# Altium schematic sheet Mcu.SchDoc
size A4
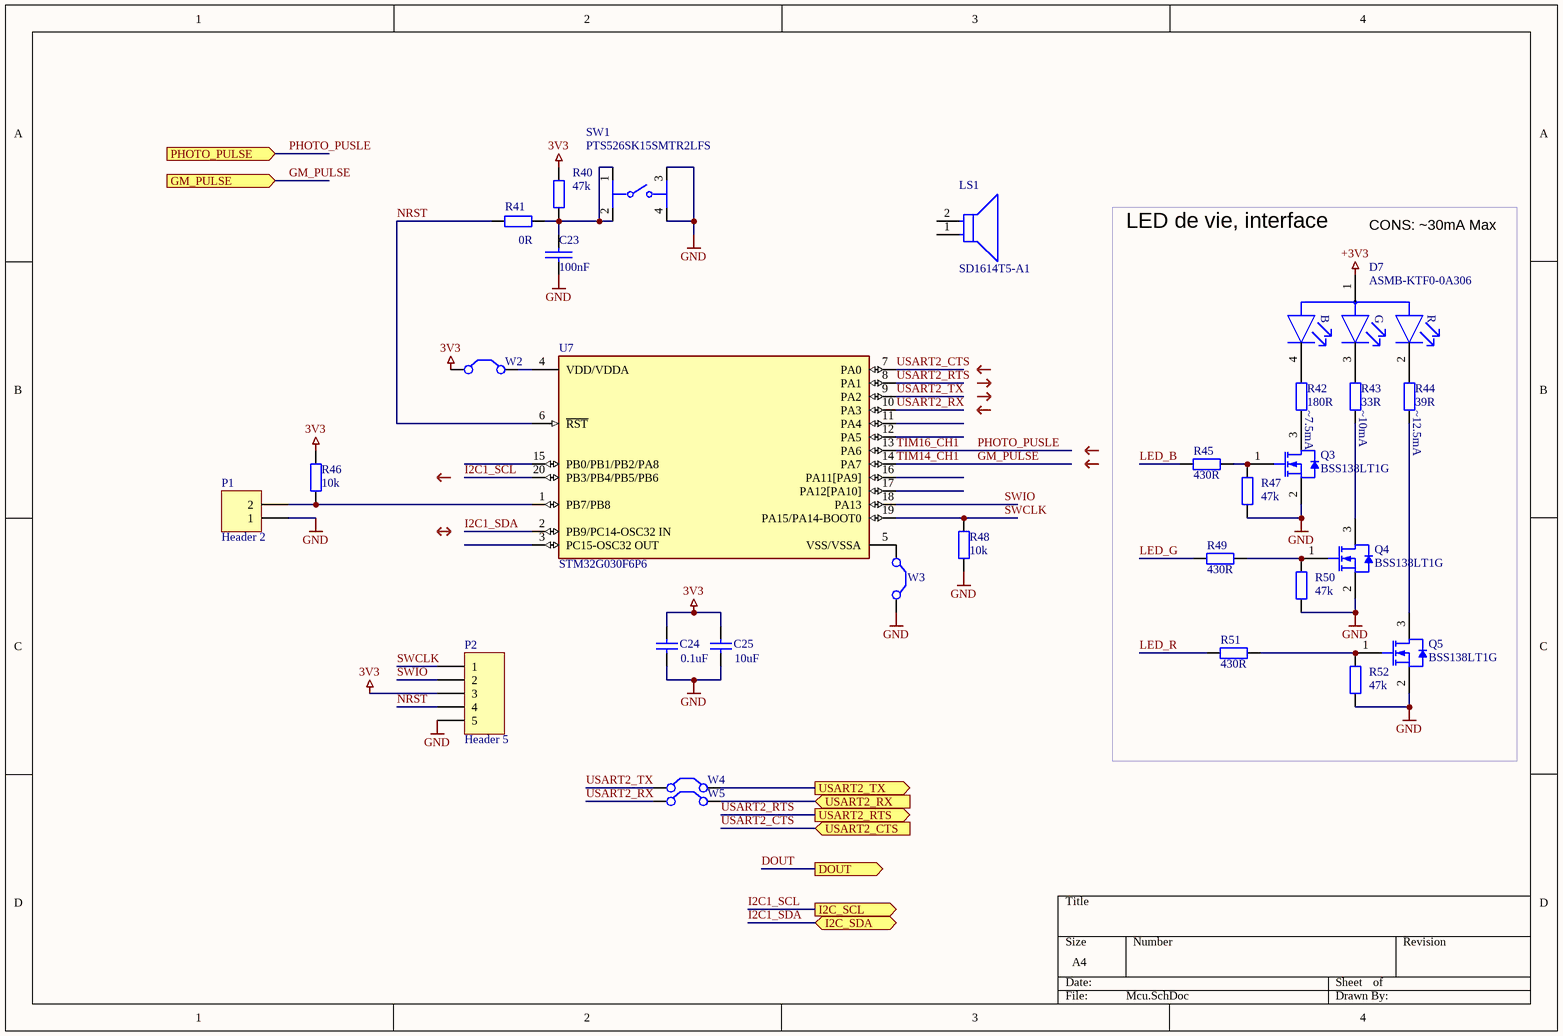
[diagram p0: Mcu.SchDoc]

## Parts
C23  100nF  [Cap_0805]
C24  0.1uF  [Cap_0805]
C25  10uF  [Cap_0805]
D7  ASMB-KTF0-0A306  [FP-PLCC-4-MFG]
LS1  SD1614T5-A1  [FP-SD1614T5-A1-MFG]
P1  Header 2  [HDR1X2]
P2  Header 5  [HDR1X5]
Q3  BSS138LT1G  [ONSC-SOT-23-3-318-08_V]
Q4  BSS138LT1G  [ONSC-SOT-23-3-318-08_V]
Q5  BSS138LT1G  [ONSC-SOT-23-3-318-08_V]
R40  47k  [RES_0805]
R41  0R  [RES_0805]
R42  value 180R  [RES_0805]  (hidden comment: 430R)
R43  value 33R  [RES_0805]  (hidden comment: 430R)
R44  value 39R  [RES_0805]  (hidden comment: 430R)
R45  430R  [RES_0805]
R46  10k  [RES_0805]
R47  value 47k  [RES_0805]  (hidden comment: 10k)
R48  10k  [RES_0805]
R49  430R  [RES_0805]
R50  value 47k  [RES_0805]  (hidden comment: 10k)
R51  430R  [RES_0805]
R52  value 47k  [RES_0805]  (hidden comment: 10k)
SW1  PTS526SK15SMTR2LFS  [FP-PTS526SK15SMTR2LFS-MFG]
U7  STM32G030F6P6  [FP-TSSOP20-YA-MFG]
W2  Jumper  [JUMPER]  (value not drawn)
W3  Jumper  [JUMPER]  (value not drawn)
W4  Jumper  [JUMPER]  (value not drawn)
W5  Jumper  [JUMPER]  (value not drawn)

## Blocks framed on the sheet
LED de vie, interface: D7 Q3-Q5 R42-R45 R47 R49-R52

## Ports
DOUT (out), GM_PULSE (in), I2C_SCL (out), I2C_SDA (bidir), PHOTO_PULSE (in), USART2_CTS (in), USART2_RTS (out), USART2_RX (in), USART2_TX (out)

## Nets
3V3: C24.2 C25.2 P2.3 R40.1 R46.2 W2.1(C1)
+3V3: D7.1(A)
GND: C23.2 C24.1 C25.1 P1.1 P2.5 Q3.2(S) Q4.2(S) Q5.2(S) R47.1 R48.1 R50.1 R52.1 SW1.3 SW1.4 W3.2(C2)
DOUT: port DOUT
GM_PULSE: U7.14(PA7) ; port GM_PULSE  [also labelled TIM14_CH1]
I2C1_SCL: U7.20(PB3/PB4/PB5/PB6) ; port I2C_SCL
I2C1_SDA: U7.2(PB9/PC14-OSC32_IN) ; port I2C_SDA
LED_B: R45.2
LED_G: R49.2
LED_R: R51.2
NRST: P2.4 R41.1 U7.6(~{RST})
PHOTO_PUSLE: U7.13(PA6) ; port PHOTO_PULSE  [also labelled TIM16_CH1]
SWCLK: P2.1 R48.2 U7.19(PA15/PA14-BOOT0)
SWIO: P2.2 U7.18(PA13)
USART2_CTS: U7.7(PA0) ; port USART2_CTS
USART2_RTS: U7.8(PA1) ; port USART2_RTS
USART2_RX: U7.10(PA3) W5.1(C1)
USART2_RX: W5.2(C2) ; port USART2_RX  [a separate net that carries the same name]
USART2_TX: U7.9(PA2) W4.1(C1)
USART2_TX: W4.2(C2) ; port USART2_TX  [a separate net that carries the same name]
NetC23_1: C23.1 R40.2 R41.2 SW1.1 SW1.2
NetD7_2: D7.2(Red_C) R44.1
NetD7_3: D7.3(Green_C) R43.1
NetD7_4: D7.4(Blue_C) R42.1
NetP1_2: P1.2 R46.1 U7.1(PB7/PB8)
NetQ3_1: Q3.1(G) R45.1 R47.2
NetQ3_3: Q3.3(D) R42.2
NetQ4_1: Q4.1(G) R49.1 R50.2
NetQ4_3: Q4.3(D) R43.2
NetQ5_1: Q5.1(G) R51.1 R52.2
NetQ5_3: Q5.3(D) R44.2
NetU7_4: U7.4(VDD/VDDA) W2.2(C2)
NetU7_5: U7.5(VSS/VSSA) W3.1(C1)

Not connected (* = marked no-connect by the designer): LS1 1(C) 2(A); U7 3(PC15-OSC32_OUT) 11(PA4) 12(PA5) 15(PB0/PB1/PB2/PA8) 16(PA11[PA9]) 17(PA12[PA10])

## Notes on the sheet
- CONS: ~30mA Max
- ~7.5mA
- (near R43) ~10mA
- (near R44) ~12.5mA
- (in symbol CMP-18399-000003-1) B; G; R

## Library data of the parts
C23 = C: SDTSourceLibName: C:\WINDOWS\TEMP\DA.LIB; PCB Footprint: RC0805
C24 C25 = Cap: Capacitor; Published: 8-Jun-2000; LatestRevisionDate: 17-Jul-2002; LatestRevisionNote: Re-released for DXP Platform.; PackageReference: RAD-0.3; Publisher: Altium Limited; PackageDescription: Radial Cap, Thru-Hole; 2 Leads; 0.3 in Pin Spacing
  C24: Value: 0.1uF
  C25: Value: 10uF
D7 = CMP-18399-000003-1: LED RGB 4PLCC SMD; Manufacturer: Broadcom; Peak Emmision Wavelength: 467/518/628nm; Luminous Intensity: 215/1100/490mcd; Power Dissipation: 66/66/48mW; Led Orientation: Top View; Colour: Blue, Green, Red; Wavelength: 471/524/620nm; Forward Current: 10/15/15mA; Reverse Voltage: 4V; Viewing Angle: 110°; Forward Voltage: 2.85/2.95/2V; Max Junction Temp: +100°C; Digikey Description: LED RGB 4PLCC SMD; ComponentLink2URL: https://docs.broadcom.com/docs/ASMB-KTF0-0A306-DS100; ComponentLink2Description: Datasheet; Manufacturer Part Number: ASMB-KTF0-0A306; Temperature Range Low: -40°C; Device Class L2: LEDs; RoHS: TRUE; Octopart: https://octopart.com/asmb-ktf0-0a306-broadcom-87157377; Package: PLCC-4; Mouser Description: LED Multi-Color Chip Red/Green/Blue 620nm/524nm/471nm 20mA 4-Pin PLCC T/R; Category: Diode; Lead Free: Yes; Height: 2.1mm; Temperature: -40°C to +85°C; Device Class L1: Optoelectronics; Automotive: No; Temperature Range High: +85°C; Device Class L3: unset
LS1 = CMP-08413-000005-1: BUZZER MAGNETIC 5V 80DB 2048HZ 1; Frequency: 2.048kHz; Operating Supply Current: 80mA; Max Operating Temperature: 85°C; Min Operating Temperature: -40°C; Voltage Rating: 5V; Termination: PC Pins; Sensing Method: Magnetic; Mount: Panel
P1 = Header 2: Header, 2-Pin; LatestRevisionDate: 17-Jul-2002; LatestRevisionNote: Re-released for DXP Platform.; Publisher: Altium Limited
P2 = Header 5: Header, 5-Pin; LatestRevisionDate: 17-Jul-2002; LatestRevisionNote: Re-released for DXP Platform.; Publisher: Altium Limited
Q3-Q5 = CMP-1058-00767-1: Power MOSFET, 200 mA, 50 V, N-Channel, 3-Pin SOT-23, Pb-Free, Tape and Reel; Manufacturer: On Semiconductor; PD Max (W): 0.225; Coss Typ (pF): 12; V(BR)DSS Min (V): 50; VGS Max (V): 20; Channel Polarity: N Channel; Configuration: Single; VGS(th) Max (V): 1.5; Ciss Typ (pF): 40; Crss Typ (pF): 3.5; ID Max (A): 0.2; ComponentLink3Description: Package Specification; PackageDescription: 3-Pin Small Outline Transistor, Body 2.92 x 1.3 mm, Pitch 0.95 mm; PackageReference: SOT-23-3-318-08; RoHS: Pb-Free; Mounting Technology: Surface Mount; ComponentLink1Description: Manufacturer URL; ComponentLink2URL: http://www.onsemi.com/pub_link/Collateral/BSS138LT1-D.PDF; ComponentLink2Description: Datasheet; Packing: Tape and Reel; PackageVersion: Rev. AP, 11/2009; PartNumber: BSS138LT1G; Package Type: SOT-23-3; ComponentLink1URL: http://www.onsemi.com/; DatasheetVersion: Rev. 8; ComponentLink3URL: http://www.onsemi.cn/pub_link/Collateral/318-08.PDF
R40 R41 = Res2: Res 0805; Value: 1K; Published: 8-Jun-2000; LatestRevisionDate: 17-Jul-2002; LatestRevisionNote: Re-released for DXP Platform.; PackageReference: AXIAL-0.4; Publisher: Altium Limited; PackageDescription: Axial Device, Thru-Hole; 2 Leads; 0.4 in Pin Spacing
R42-R45 R47 R49-R52 = Res2: Res 0805; Published: 8-Jun-2000; LatestRevisionDate: 17-Jul-2002; LatestRevisionNote: Re-released for DXP Platform.; PackageReference: AXIAL-0.4; Publisher: Altium Limited; PackageDescription: Axial Device, Thru-Hole; 2 Leads; 0.4 in Pin Spacing
  R45 R49 R51: Value: 430R
R46 R48 = Res2: Resistor; Published: 8-Jun-2000; LatestRevisionDate: 17-Jul-2002; LatestRevisionNote: Re-released for DXP Platform.; PackageReference: AXIAL-0.4; Publisher: Altium Limited; PackageDescription: Axial Device, Thru-Hole; 2 Leads; 0.4 in Pin Spacing; Value: 10k
SW1 = CMP-10040-000013-1: TACT 5.2 X 5.2, 1.5 MM H, 260GF,; Manufacturer: C&K; Operating Force: 250gf; Throw Configuration: SPST-NO; Contact Current Rating: 50mA; Standoff Height: 0mm; Contact Resistance: 100mΩ; Voltage Rating Dc: 12V; Electromechanical Life: 200000Cycles; Device Class L3: Tactile Switches; Device Class L2: Switches; Temperature: -20°C to +70°C; Temperature Range Low: -20°C; Package: PTS526SK15SMTR2LFS; Temperature Range High: +70°C; ComponentLink2Description: Datasheet; Device Class L1: Electromechanical; Height: 1.65mm; Digikey Description: TACT 5.2 X 5.2, 1.5 MM H, 260GF,; Category: Switch; RoHS: TRUE; Automotive: No; Lead Free: Yes; Manufacturer Part Number: PTS526SK15SMTR2LFS; Octopart: https://octopart.com/pts526+sk15+smtr2+lfs-c%26k+components-100617999; ComponentLink2URL: https://www.ckswitches.com/media/2780/pts526.pdf
U7 = CMP-12105-000034-1: ARM MICROCONTROLLERS - MCU; Manufacturer: STMicroelectronics; Max Supply Voltage: 3.6V; Interface: I2C,SPI,USART,LIN,IrDA,I2S,SMBus; Memory Size: 32KBytes; Number Of I/Os: 17; Number Of Timers/Counters: 6; Core Architecture: ARM Cortex-M0+; Number Of Pwm Channels: 11; Standoff Height: 0.05mm; Number Of A/D Converters: 1; Number Of I2C Channels: 2; Data Bus Width: 32bits; Ram Size: 8KBytes; Max Junction Temp: +105°C; Number Of Spi Channels: 3; Min Supply Voltage: 2V; Number Of Adc Channels: 16; Memory Type: FLASH; Frequency: 64MHz; Ambient Temperature Range Low: -40°C; ComponentLink2URL: https://www.st.com/resource/en/datasheet/stm32g030f6.pdf; Temperature Range Low: -40°C; Automotive: No; Device Class L1: Integrated Circuits (ICs); Category: IC; Temperature Range High: +85°C; ComponentLink2Description: Datasheet; Device Class L2: Embedded Processors and Controllers; Manufacturer Part Number: STM32G030F6P6; Height: 1.2mm; Ambient Temperature Range High: +85°C; Octopart: https://octopart.com/stm32g030f6p6-stmicroelectronics-103773023; Package: TSSOP20-YA; Temperature: -40°C to +85°C; Lead Free: Yes; Device Class L3: Microcontrollers; Number Of Uart Channels: 2; RoHS: TRUE; Number Of Cores: 1; Digikey Description: ARM MICROCONTROLLERS - MCU
W2-W5 = Jumper: Jumper Wire; Published: 24-Mar-1999; LatestRevisionDate: 17-Jul-2002; LatestRevisionNote: Re-released for DXP Platform.; PackageReference: RAD-0.2; Publisher: Altium Limited; PackageDescription: Radial Cap, Thru-Hole; 2 Leads; 0.2 in Pin Spacing